# EAGLE schematic Arduino (EAGLE 7.1.0)
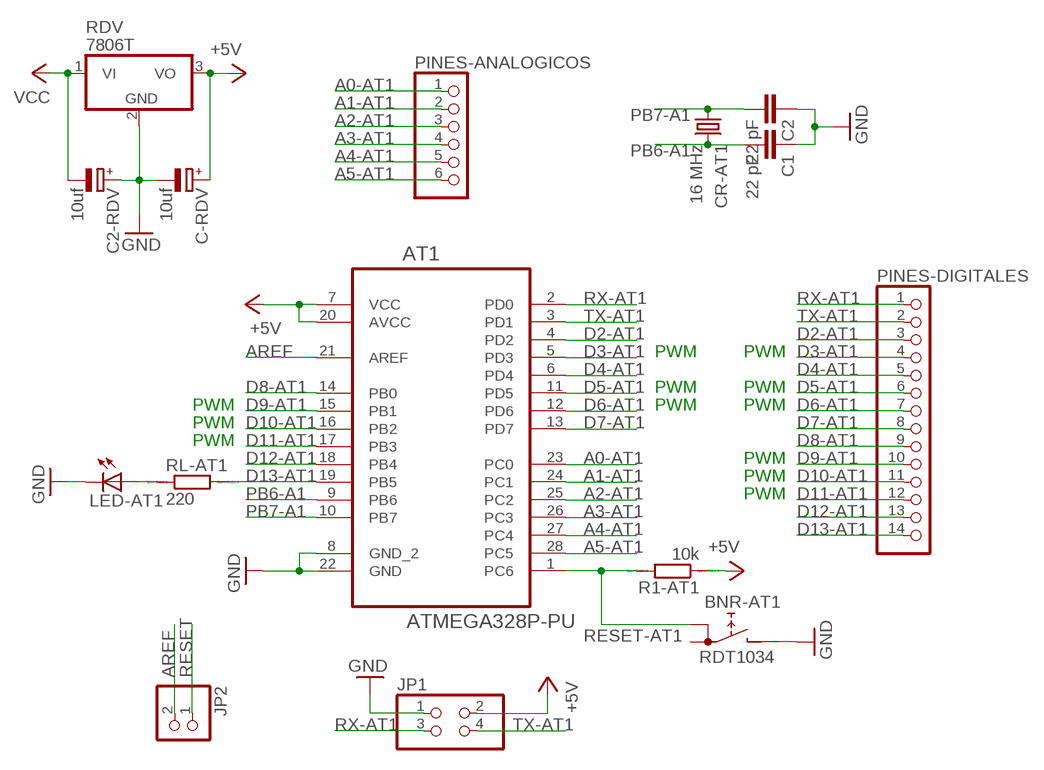
[diagram p0: schematic, sheet 1]

## Parts
AT1  ATMEGA328P-PU  [DIP254P762X457-28]
BNR-AT1  RDT1034  [RDT1034]
C1  22 pF  C2,5-3  [C2.5-3]
C2  22 pF  C2,5-3  [C2.5-3]
C2-RDV  10uf  CPOL-EUTT5D9  [TT5D9]
C-RDV  10uf  CPOL-EUTT5D9  [TT5D9]
CR-AT1  16 MHz  CRYSTALHC49U70  [HC49U70]
JP1  PINHD-2X2  [2X02]
JP2  PINHD-1X2  [1X02]
LED-AT1  LED5MM  [LED5MM]
PINES-ANALOGICOS  PINHD-1X6  [1X06]
PINES-DIGITALES  PINHD-1X14  [1X14]
R1-AT1  10k  R-EU_0207_7  [0207/7]
RDV  7806T  [TO220H]
RL-AT1  220  R-EU_0207_7  [0207/7]

## Nets
+5V: AT1.7(VCC) AT1.20(AVCC) C-RDV.+ JP1.2 R1-AT1.1 RDV.3(VO)
A0-AT1: AT1.23(PC0) PINES-ANALOGICOS.1
A1-AT1: AT1.24(PC1) PINES-ANALOGICOS.2
A2-AT1: AT1.25(PC2) PINES-ANALOGICOS.3
A3-AT1: AT1.26(PC3) PINES-ANALOGICOS.4
A4-AT1: AT1.27(PC4) PINES-ANALOGICOS.5
A5-AT1: AT1.28(PC5) PINES-ANALOGICOS.6
AREF: AT1.21(AREF) JP2.2
D2-AT1: AT1.4(PD2) PINES-DIGITALES.3
D3-AT1: AT1.5(PD3) PINES-DIGITALES.4
D4-AT1: AT1.6(PD4) PINES-DIGITALES.5
D5-AT1: AT1.11(PD5) PINES-DIGITALES.6
D6-AT1: AT1.12(PD6) PINES-DIGITALES.7
D7-AT1: AT1.13(PD7) PINES-DIGITALES.8
D8-AT1: AT1.14(PB0) PINES-DIGITALES.9
D9-AT1: AT1.15(PB1) PINES-DIGITALES.10
D10-AT1: AT1.16(PB2) PINES-DIGITALES.11
D11-AT1: AT1.17(PB3) PINES-DIGITALES.12
D12-AT1: AT1.18(PB4) PINES-DIGITALES.13
D13-AT1: AT1.19(PB5) PINES-DIGITALES.14 RL-AT1.2
GND: AT1.8(GND_2) AT1.22(GND) BNR-AT1.B C1.1 C2-RDV.+ C2.1 C-RDV.- JP1.1 LED-AT1.K(C) RDV.2(GND)
N$1: LED-AT1.A RL-AT1.1
PB6-A1: AT1.9(PB6) C1.2 CR-AT1.2
PB7-A1: AT1.10(PB7) C2.2 CR-AT1.1
RESET: JP2.1
RESET-AT1: AT1.1(PC6) BNR-AT1.A R1-AT1.2
RX-AT1: AT1.2(PD0) JP1.3 PINES-DIGITALES.1
TX-AT1: AT1.3(PD1) JP1.4 PINES-DIGITALES.2
VCC: C2-RDV.- RDV.1(VI)
Unconnected: BNR-AT1.A1

## Notes on the sheet
- PWM | PWM
- PWM | PWM
- PWM | PWM | PWM
- PWM
- PWM
- PWM
- PWM
- PWM

## Library data of the parts
AT1 = Atmel_By_element14_Batch_1-00:ATMEGA328P-PU: 8-bit Microcontroller with In-System Programmable Flash; MPN: ATMEGA328P-PU; OC_FARNELL: 1715487; OC_NEWARK: 15R0268; PACKAGE: PDIP-28; SUPPLIER: Atmel
BNR-AT1 = switch:RDT1034: PUSH SWITCH www.radiohm.com
C1 C2 = capacitor-wima:C: CAPACITOR naming: grid - package width
C2-RDV C-RDV = resistor:CPOL-EU: POLARIZED CAPACITOR, European symbol
CR-AT1 = crystal:CRYSTAL: CRYSTAL; OC_FARNELL: unknown; OC_NEWARK: unknown
JP1 = pinhead:PINHD-2X2: PIN HEADER
JP2 = pinhead:PINHD-1X2: PIN HEADER
LED-AT1 = led:LED: LED OSRAM: - CHIPLED LG R971, LG N971, LY N971, LG Q971, LY Q971, LO R971, LY R971 LH N974, LH R974 LS Q976, LO Q976, LY Q976 LO Q996 - Hyper CHIPLED LW Q18S LB Q993, LB Q99A, LB R99A - SideLED LS A670, LO A670, LY A670, LG A670, LP A670 LB A673, LV A673, LT A673, LW A673 LH A674 LY A675 LS A676, LA A676, LO A676, LY A676, LW A676 LS A679, LY A679, LG A679 - Hyper Micro SIDELED® LS Y876, LA Y876, LO Y876, LY Y876 LT Y87S - SmartLED LW L88C, LW L88S LB L89C, LB L89S, LG L890 LS L89K, LO L89K, LY L89K LS L896, LA L896, LO L896, LY L896 - TOPLED LS T670, LO T670, LY T670, LG T670, LP T670 LSG T670, LSP T670, LSY T670, LOP T670, LYG T670 LG T671, LOG T671, LSG T671 LB T673, LV T673, LT T673, LW T673 LH T674 LS T676, LA T676, LO T676, LY T676, LB T676, LH T676, LSB T676, LW T676 LB T67C, LV T67C, LT T67C, LS T67K, LO T67K, LY T67K, LW E67C LS E67B, LA E67B, LO E67B, LY E67B, LB E67C, LV E67C, LT E67C LW T67C LS T679, LY T679, LG T679 LS T770, LO T770, LY T770, LG T770, LP T770 LB T773, LV T773, LT T773, LW T773 LH T774 LS E675, LA E675, LY E675, LS T675 LS T776, LA T776, LO T776, LY T776, LB T776 LHGB T686 LT T68C, LB T68C - Hyper Mini TOPLED® LB M676 - Mini TOPLED Santana® LG M470 LS M47K, LO M47K, LY M47K Source: http://www.osram.convergy.de LUXEON: - LUMILED® LXK2-PW12-R00, LXK2-PW12-S00, LXK2-PW14-U00, LXK2-PW14-V00 LXK2-PM12-R00, LXK2-PM12-S00, LXK2-PM14-U00 LXK2-PE12-Q00, LXK2-PE12-R00, LXK2-PE12-S00, LXK2-PE14-T00, LXK2-PE14-U00 LXK2-PB12-K00, LXK2-PB12-L00, LXK2-PB12-M00, LXK2-PB14-N00, LXK2-PB14-P00, LXK2-PB14-Q00 LXK2-PR12-L00, LXK2-PR12-M00, LXK2-PR14-Q00, LXK2-PR14-R00 LXK2-PD12-Q00, LXK2-PD12-R00, LXK2-PD12-S00 LXK2-PH12-R00, LXK2-PH12-S00 LXK2-PL12-P00, LXK2-PL12-Q00, LXK2-PL12-R00 Source: www.luxeon.com KINGBRIGHT: KA-3528ASYC Source: www.kingbright.com
PINES-ANALOGICOS = pinhead:PINHD-1X6: PIN HEADER
PINES-DIGITALES = pinhead:PINHD-1X14: PIN HEADER
R1-AT1 RL-AT1 = resistor:R-EU_: RESISTOR, European symbol; SPICEPREFIX: R
RDV = linear:78*: Positive VOLTAGE REGULATOR Source: http://cache.national.com/ds/LM/LM78L05.pdf http://www.fairchildsemi.com/ds/LM/LM7805.pdf

## Net classes
0 default: width 0.152 mm, drill 0.305 mm, clearance 0.152 mm